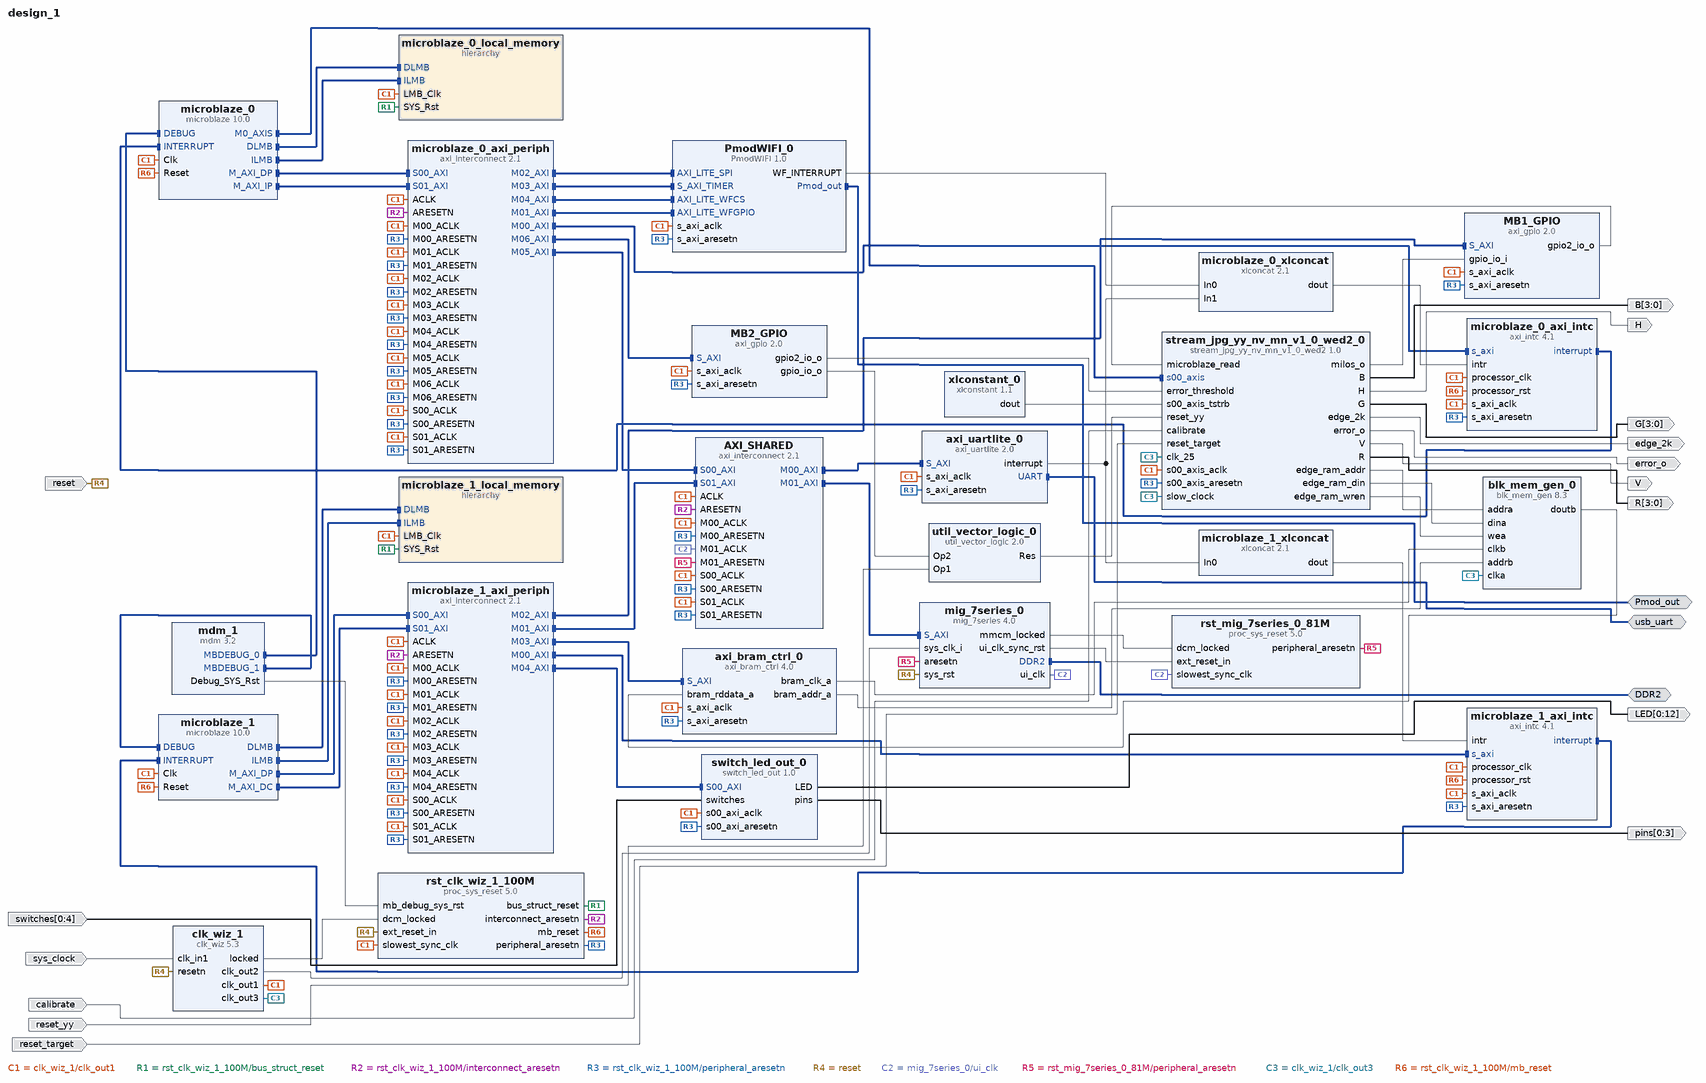
[diagram p0: block diagram of the top level]
# Vivado block design design_1, xc7a100tcsg324-1, Vivado 2016.4
create_bd_design design_1

create_bd_intf_port -mode Master -vlnv xilinx.com:interface:ddrx_rtl:1.0 DDR2
create_bd_intf_port -mode Master -vlnv digilentinc.com:interface:pmod_rtl:1.0 Pmod_out
create_bd_intf_port -mode Master -vlnv xilinx.com:interface:uart_rtl:1.0 usb_uart
create_bd_port -dir I -type rst reset
set_property -dict {CONFIG.POLARITY ACTIVE_LOW} [get_bd_ports reset]
create_bd_port -dir I -type clk sys_clock
set_property -dict {CONFIG.FREQ_HZ 100000000 CONFIG.PHASE 0.000} [get_bd_ports sys_clock]
create_bd_port -dir O H
create_bd_port -dir O V
create_bd_port -dir O -from 3 -to 0 G
create_bd_port -dir O -from 3 -to 0 B
create_bd_port -dir O -from 3 -to 0 R
create_bd_port -dir I calibrate
create_bd_port -dir O error_o
create_bd_port -dir O -from 0 -to 12 LED
create_bd_port -dir O -from 0 -to 3 pins
create_bd_port -dir I reset_yy
create_bd_port -dir O edge_2k
create_bd_port -dir I reset_target
create_bd_port -dir I -from 0 -to 4 switches

create_bd_cell -type hier microblaze_0_local_memory
create_bd_cell -type ip -vlnv xilinx.com:ip:xlconcat:2.1 microblaze_0_xlconcat
set_property -dict {CONFIG.NUM_PORTS 2} [get_bd_cells microblaze_0_xlconcat]
create_bd_cell -type hier microblaze_1_local_memory
create_bd_cell -type ip -vlnv xilinx.com:ip:xlconcat:2.1 microblaze_1_xlconcat
set_property -dict {CONFIG.NUM_PORTS 1} [get_bd_cells microblaze_1_xlconcat]
create_bd_cell -type ip -vlnv user:user:switch_led_out:1.0 switch_led_out_0
create_bd_cell -type ip -vlnv xilinx.com:ip:util_vector_logic:2.0 util_vector_logic_0
set_property -dict {CONFIG.C_SIZE 1 CONFIG.C_OPERATION or} [get_bd_cells util_vector_logic_0]
create_bd_cell -type ip -vlnv xilinx.com:ip:xlconstant:1.1 xlconstant_0
set_property -dict {CONFIG.CONST_WIDTH 4 CONFIG.CONST_VAL 0} [get_bd_cells xlconstant_0]
create_bd_cell -type ip -vlnv user:user:stream_jpg_yy_nv_mn_v1_0_wed2:1.0 stream_jpg_yy_nv_mn_v1_0_wed2_0
create_bd_cell -type ip -vlnv xilinx.com:ip:axi_gpio:2.0 MB2_GPIO
set_property -dict [list \
  CONFIG.C_GPIO_WIDTH 1 \
  CONFIG.C_GPIO2_WIDTH 16 \
  CONFIG.C_IS_DUAL 1 \
  CONFIG.C_ALL_INPUTS 0 \
  CONFIG.C_ALL_INPUTS_2 0 \
  CONFIG.C_ALL_OUTPUTS 1 \
  CONFIG.C_ALL_OUTPUTS_2 1 \
] [get_bd_cells MB2_GPIO]
create_bd_cell -type ip -vlnv digilentinc.com:IP:PmodWIFI:1.0 PmodWIFI_0
create_bd_cell -type ip -vlnv xilinx.com:ip:axi_bram_ctrl:4.0 axi_bram_ctrl_0
set_property -dict {CONFIG.PROTOCOL AXI4LITE CONFIG.SINGLE_PORT_BRAM 1} [get_bd_cells axi_bram_ctrl_0]
create_bd_cell -type ip -vlnv xilinx.com:ip:axi_gpio:2.0 MB1_GPIO
set_property -dict [list \
  CONFIG.C_IS_DUAL 1 \
  CONFIG.C_ALL_INPUTS 1 \
  CONFIG.C_ALL_INPUTS_2 0 \
  CONFIG.C_ALL_OUTPUTS_2 1 \
] [get_bd_cells MB1_GPIO]
create_bd_cell -type ip -vlnv xilinx.com:ip:axi_uartlite:2.0 axi_uartlite_0
set_property -dict {CONFIG.USE_BOARD_FLOW true CONFIG.UARTLITE_BOARD_INTERFACE USB_Uart} [get_bd_cells axi_uartlite_0]
create_bd_cell -type ip -vlnv xilinx.com:ip:blk_mem_gen:8.3 blk_mem_gen_0
set_property -dict [list \
  CONFIG.Memory_Type Simple_Dual_Port_RAM \
  CONFIG.Enable_32bit_Address false \
  CONFIG.Use_Byte_Write_Enable false \
  CONFIG.Write_Width_A 20 \
  CONFIG.Operating_Mode_A NO_CHANGE \
  CONFIG.Enable_A Always_Enabled \
  CONFIG.Write_Width_B 20 \
  CONFIG.Read_Width_B 20 \
  CONFIG.Enable_B Always_Enabled \
  CONFIG.Register_PortB_Output_of_Memory_Primitives true \
  CONFIG.Load_Init_File true \
  CONFIG.Coe_File ../../../../edge_ram_init.coe \
  CONFIG.Port_B_Clock 100 \
  CONFIG.Port_B_Enable_Rate 100 \
  CONFIG.use_bram_block Stand_Alone \
] [get_bd_cells blk_mem_gen_0]
create_bd_cell -type ip -vlnv xilinx.com:ip:clk_wiz:5.3 clk_wiz_1
set_property -dict [list \
  CONFIG.CLKOUT2_USED true \
  CONFIG.CLKOUT3_USED true \
  CONFIG.CLKOUT4_USED false \
  CONFIG.NUM_OUT_CLKS 3 \
  CONFIG.CLKOUT1_REQUESTED_OUT_FREQ 100.000 \
  CONFIG.CLKOUT2_REQUESTED_OUT_FREQ 200.000 \
  CONFIG.CLKOUT3_REQUESTED_OUT_FREQ 25 \
  CONFIG.CLKOUT4_REQUESTED_OUT_FREQ 100.000 \
  CONFIG.PRIM_SOURCE Single_ended_clock_capable_pin \
  CONFIG.RESET_PORT resetn \
  CONFIG.MMCM_DIVCLK_DIVIDE 1 \
  CONFIG.MMCM_CLKOUT0_DIVIDE_F 10.000 \
  CONFIG.MMCM_CLKOUT1_DIVIDE 5 \
  CONFIG.MMCM_CLKOUT2_DIVIDE 40 \
  CONFIG.MMCM_CLKOUT3_DIVIDE 1 \
  CONFIG.RESET_TYPE ACTIVE_LOW \
  CONFIG.USE_BOARD_FLOW true \
  CONFIG.CLK_IN1_BOARD_INTERFACE Custom \
  CONFIG.RESET_BOARD_INTERFACE reset \
  CONFIG.CLKOUT1_JITTER 130.958 \
  CONFIG.CLKOUT2_JITTER 114.829 \
  CONFIG.CLKOUT2_PHASE_ERROR 98.575 \
  CONFIG.CLKOUT3_JITTER 175.402 \
  CONFIG.CLKOUT3_PHASE_ERROR 98.575 \
  CONFIG.CLKOUT4_JITTER 151.636 \
  CONFIG.CLKOUT4_PHASE_ERROR 98.575 \
] [get_bd_cells clk_wiz_1]
create_bd_cell -type ip -vlnv xilinx.com:ip:mdm:3.2 mdm_1
set_property -dict {CONFIG.C_MB_DBG_PORTS 2} [get_bd_cells mdm_1]
create_bd_cell -type ip -vlnv xilinx.com:ip:microblaze:10.0 microblaze_0
set_property -dict [list \
  CONFIG.C_AREA_OPTIMIZED 1 \
  CONFIG.C_D_AXI 1 \
  CONFIG.C_D_LMB 1 \
  CONFIG.C_I_AXI 1 \
  CONFIG.C_I_LMB 1 \
  CONFIG.C_USE_REORDER_INSTR 0 \
  CONFIG.C_USE_BARREL 1 \
  CONFIG.C_USE_DIV 1 \
  CONFIG.C_USE_HW_MUL 1 \
  CONFIG.C_USE_FPU 1 \
  CONFIG.C_DEBUG_ENABLED 1 \
  CONFIG.C_FSL_LINKS 1 \
  CONFIG.C_USE_EXTENDED_FSL_INSTR 1 \
] [get_bd_cells microblaze_0]
create_bd_cell -type ip -vlnv xilinx.com:ip:axi_intc:4.1 microblaze_0_axi_intc
set_property -dict {CONFIG.C_HAS_FAST 1} [get_bd_cells microblaze_0_axi_intc]
create_bd_cell -type ip -vlnv xilinx.com:ip:axi_interconnect:2.1 microblaze_0_axi_periph
set_property -dict [list \
  CONFIG.NUM_SI 2 \
  CONFIG.NUM_MI 7 \
  CONFIG.ENABLE_ADVANCED_OPTIONS 1 \
  CONFIG.M00_HAS_REGSLICE 3 \
  CONFIG.M01_HAS_REGSLICE 3 \
  CONFIG.M02_HAS_REGSLICE 3 \
  CONFIG.M03_HAS_REGSLICE 3 \
  CONFIG.M04_HAS_REGSLICE 3 \
  CONFIG.M05_HAS_REGSLICE 3 \
  CONFIG.M06_HAS_REGSLICE 3 \
  CONFIG.S00_HAS_REGSLICE 3 \
  CONFIG.S01_HAS_REGSLICE 3 \
  CONFIG.S02_HAS_REGSLICE 3 \
] [get_bd_cells microblaze_0_axi_periph]
create_bd_cell -type ip -vlnv xilinx.com:ip:axi_interconnect:2.1 AXI_SHARED
set_property -dict [list \
  CONFIG.NUM_SI 2 \
  CONFIG.NUM_MI 2 \
  CONFIG.ENABLE_ADVANCED_OPTIONS 1 \
  CONFIG.M00_HAS_REGSLICE 3 \
  CONFIG.M01_HAS_REGSLICE 3 \
  CONFIG.M02_HAS_REGSLICE 3 \
  CONFIG.M03_HAS_REGSLICE 3 \
  CONFIG.M04_HAS_REGSLICE 3 \
  CONFIG.M05_HAS_REGSLICE 3 \
  CONFIG.M06_HAS_REGSLICE 3 \
  CONFIG.S00_HAS_REGSLICE 3 \
  CONFIG.S01_HAS_REGSLICE 3 \
  CONFIG.S02_HAS_REGSLICE 3 \
] [get_bd_cells AXI_SHARED]
create_bd_cell -type ip -vlnv xilinx.com:ip:microblaze:10.0 microblaze_1
set_property -dict [list \
  CONFIG.C_D_AXI 1 \
  CONFIG.C_D_LMB 1 \
  CONFIG.C_I_LMB 1 \
  CONFIG.C_USE_MSR_INSTR 1 \
  CONFIG.C_USE_PCMP_INSTR 1 \
  CONFIG.C_USE_BARREL 1 \
  CONFIG.C_USE_DIV 1 \
  CONFIG.C_USE_HW_MUL 1 \
  CONFIG.C_USE_FPU 1 \
  CONFIG.C_DEBUG_ENABLED 1 \
  CONFIG.C_USE_ICACHE 0 \
  CONFIG.C_USE_DCACHE 1 \
  CONFIG.C_DCACHE_BYTE_SIZE 65536 \
  CONFIG.C_DCACHE_USE_WRITEBACK 1 \
  CONFIG.C_DCACHE_VICTIMS 0 \
  CONFIG.C_DCACHE_DATA_WIDTH 2 \
  CONFIG.C_USE_BRANCH_TARGET_CACHE 1 \
  CONFIG.C_BRANCH_TARGET_CACHE_SIZE 7 \
] [get_bd_cells microblaze_1]
create_bd_cell -type ip -vlnv xilinx.com:ip:axi_intc:4.1 microblaze_1_axi_intc
set_property -dict {CONFIG.C_HAS_FAST 1} [get_bd_cells microblaze_1_axi_intc]
create_bd_cell -type ip -vlnv xilinx.com:ip:axi_interconnect:2.1 microblaze_1_axi_periph
set_property -dict [list \
  CONFIG.NUM_SI 2 \
  CONFIG.NUM_MI 5 \
  CONFIG.ENABLE_ADVANCED_OPTIONS 1 \
  CONFIG.M00_HAS_REGSLICE 3 \
  CONFIG.S00_HAS_REGSLICE 3 \
  CONFIG.S01_HAS_REGSLICE 3 \
] [get_bd_cells microblaze_1_axi_periph]
create_bd_cell -type ip -vlnv xilinx.com:ip:mig_7series:4.0 mig_7series_0
create_bd_cell -type ip -vlnv xilinx.com:ip:proc_sys_reset:5.0 rst_clk_wiz_1_100M
set_property -dict {CONFIG.USE_BOARD_FLOW false CONFIG.RESET_BOARD_INTERFACE Custom} [get_bd_cells rst_clk_wiz_1_100M]
create_bd_cell -type ip -vlnv xilinx.com:ip:proc_sys_reset:5.0 rst_mig_7series_0_81M

# ---- hierarchy /microblaze_0_local_memory ----
current_bd_instance /microblaze_0_local_memory
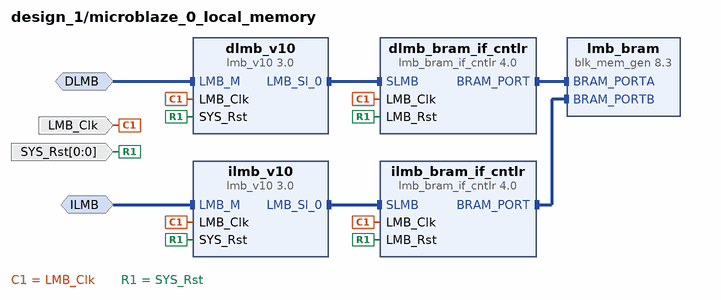
[diagram p1: block diagram inside /microblaze_0_local_memory]
create_bd_intf_pin -mode MirroredMaster -vlnv xilinx.com:interface:lmb_rtl:1.0 DLMB
create_bd_intf_pin -mode MirroredMaster -vlnv xilinx.com:interface:lmb_rtl:1.0 ILMB
create_bd_pin -dir I -type clk LMB_Clk
create_bd_pin -dir I -from 0 -to 0 -type rst SYS_Rst

create_bd_cell -type ip -vlnv xilinx.com:ip:lmb_bram_if_cntlr:4.0 dlmb_bram_if_cntlr
set_property -dict {CONFIG.C_ECC 0} [get_bd_cells dlmb_bram_if_cntlr]
create_bd_cell -type ip -vlnv xilinx.com:ip:lmb_v10:3.0 dlmb_v10
create_bd_cell -type ip -vlnv xilinx.com:ip:lmb_bram_if_cntlr:4.0 ilmb_bram_if_cntlr
set_property -dict {CONFIG.C_ECC 0} [get_bd_cells ilmb_bram_if_cntlr]
create_bd_cell -type ip -vlnv xilinx.com:ip:lmb_v10:3.0 ilmb_v10
create_bd_cell -type ip -vlnv xilinx.com:ip:blk_mem_gen:8.3 lmb_bram
set_property -dict {CONFIG.Memory_Type True_Dual_Port_RAM CONFIG.use_bram_block BRAM_Controller} [get_bd_cells lmb_bram]

# ---- hierarchy /microblaze_1_local_memory ----
current_bd_instance /microblaze_1_local_memory
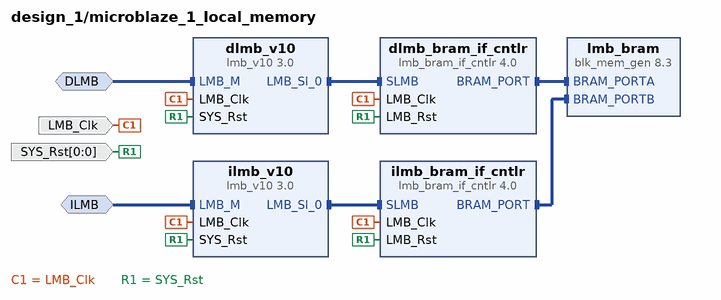
[diagram p2: block diagram inside /microblaze_1_local_memory]
create_bd_intf_pin -mode MirroredMaster -vlnv xilinx.com:interface:lmb_rtl:1.0 DLMB
create_bd_intf_pin -mode MirroredMaster -vlnv xilinx.com:interface:lmb_rtl:1.0 ILMB
create_bd_pin -dir I -type clk LMB_Clk
create_bd_pin -dir I -from 0 -to 0 -type rst SYS_Rst

create_bd_cell -type ip -vlnv xilinx.com:ip:lmb_bram_if_cntlr:4.0 dlmb_bram_if_cntlr
set_property -dict {CONFIG.C_ECC 0} [get_bd_cells dlmb_bram_if_cntlr]
create_bd_cell -type ip -vlnv xilinx.com:ip:lmb_v10:3.0 dlmb_v10
create_bd_cell -type ip -vlnv xilinx.com:ip:lmb_bram_if_cntlr:4.0 ilmb_bram_if_cntlr
set_property -dict {CONFIG.C_ECC 0} [get_bd_cells ilmb_bram_if_cntlr]
create_bd_cell -type ip -vlnv xilinx.com:ip:lmb_v10:3.0 ilmb_v10
create_bd_cell -type ip -vlnv xilinx.com:ip:blk_mem_gen:8.3 lmb_bram
set_property -dict {CONFIG.Memory_Type True_Dual_Port_RAM CONFIG.use_bram_block BRAM_Controller} [get_bd_cells lmb_bram]

# ---- connections ----

current_bd_instance /microblaze_0_local_memory
connect_bd_intf_net [get_bd_intf_pins dlmb_v10/LMB_Sl_0] [get_bd_intf_pins dlmb_bram_if_cntlr/SLMB]
connect_bd_intf_net [get_bd_intf_pins ilmb_v10/LMB_Sl_0] [get_bd_intf_pins ilmb_bram_if_cntlr/SLMB]
connect_bd_intf_net [get_bd_intf_pins dlmb_bram_if_cntlr/BRAM_PORT] [get_bd_intf_pins lmb_bram/BRAM_PORTA]
connect_bd_intf_net [get_bd_intf_pins ilmb_bram_if_cntlr/BRAM_PORT] [get_bd_intf_pins lmb_bram/BRAM_PORTB]
connect_bd_intf_net [get_bd_intf_pins DLMB] [get_bd_intf_pins dlmb_v10/LMB_M]
connect_bd_intf_net [get_bd_intf_pins ILMB] [get_bd_intf_pins ilmb_v10/LMB_M]
connect_bd_net -net microblaze_0_Clk [get_bd_pins LMB_Clk] \
  [get_bd_pins dlmb_bram_if_cntlr/LMB_Clk] [get_bd_pins dlmb_v10/LMB_Clk] [get_bd_pins ilmb_bram_if_cntlr/LMB_Clk] \
  [get_bd_pins ilmb_v10/LMB_Clk]
connect_bd_net [get_bd_pins SYS_Rst] \
  [get_bd_pins dlmb_bram_if_cntlr/LMB_Rst] [get_bd_pins dlmb_v10/SYS_Rst] [get_bd_pins ilmb_bram_if_cntlr/LMB_Rst] \
  [get_bd_pins ilmb_v10/SYS_Rst]

current_bd_instance /microblaze_1_local_memory
connect_bd_intf_net [get_bd_intf_pins dlmb_v10/LMB_Sl_0] [get_bd_intf_pins dlmb_bram_if_cntlr/SLMB]
connect_bd_intf_net [get_bd_intf_pins ilmb_v10/LMB_Sl_0] [get_bd_intf_pins ilmb_bram_if_cntlr/SLMB]
connect_bd_intf_net [get_bd_intf_pins dlmb_bram_if_cntlr/BRAM_PORT] [get_bd_intf_pins lmb_bram/BRAM_PORTA]
connect_bd_intf_net [get_bd_intf_pins ilmb_bram_if_cntlr/BRAM_PORT] [get_bd_intf_pins lmb_bram/BRAM_PORTB]
connect_bd_intf_net [get_bd_intf_pins DLMB] [get_bd_intf_pins dlmb_v10/LMB_M]
connect_bd_intf_net [get_bd_intf_pins ILMB] [get_bd_intf_pins ilmb_v10/LMB_M]
connect_bd_net -net microblaze_1_Clk [get_bd_pins LMB_Clk] \
  [get_bd_pins dlmb_bram_if_cntlr/LMB_Clk] [get_bd_pins dlmb_v10/LMB_Clk] [get_bd_pins ilmb_bram_if_cntlr/LMB_Clk] \
  [get_bd_pins ilmb_v10/LMB_Clk]
connect_bd_net [get_bd_pins SYS_Rst] \
  [get_bd_pins dlmb_bram_if_cntlr/LMB_Rst] [get_bd_pins dlmb_v10/SYS_Rst] [get_bd_pins ilmb_bram_if_cntlr/LMB_Rst] \
  [get_bd_pins ilmb_v10/SYS_Rst]

current_bd_instance /
connect_bd_intf_net [get_bd_intf_pins microblaze_0/DLMB] [get_bd_intf_pins microblaze_0_local_memory/DLMB]
connect_bd_intf_net [get_bd_intf_pins microblaze_0/ILMB] [get_bd_intf_pins microblaze_0_local_memory/ILMB]
connect_bd_intf_net [get_bd_intf_pins microblaze_0_axi_periph/S00_AXI] [get_bd_intf_pins microblaze_0/M_AXI_DP]
connect_bd_intf_net [get_bd_intf_pins microblaze_0_axi_intc/interrupt] [get_bd_intf_pins microblaze_0/INTERRUPT]
connect_bd_intf_net [get_bd_intf_pins microblaze_0_axi_periph/M00_AXI] [get_bd_intf_pins microblaze_0_axi_intc/s_axi]
connect_bd_intf_net [get_bd_intf_pins mdm_1/MBDEBUG_0] [get_bd_intf_pins microblaze_0/DEBUG]
connect_bd_intf_net [get_bd_intf_pins microblaze_0/M_AXI_IP] [get_bd_intf_pins microblaze_0_axi_periph/S01_AXI]
connect_bd_intf_net [get_bd_intf_pins stream_jpg_yy_nv_mn_v1_0_wed2_0/s00_axis] [get_bd_intf_pins microblaze_0/M0_AXIS]
connect_bd_intf_net [get_bd_intf_pins microblaze_0_axi_periph/M02_AXI] [get_bd_intf_pins PmodWIFI_0/AXI_LITE_SPI]
connect_bd_intf_net [get_bd_intf_pins microblaze_0_axi_periph/M03_AXI] [get_bd_intf_pins PmodWIFI_0/S_AXI_TIMER]
connect_bd_intf_net [get_bd_intf_pins microblaze_0_axi_periph/M04_AXI] [get_bd_intf_pins PmodWIFI_0/AXI_LITE_WFCS]
connect_bd_intf_net [get_bd_intf_pins microblaze_1/DLMB] [get_bd_intf_pins microblaze_1_local_memory/DLMB]
connect_bd_intf_net [get_bd_intf_pins microblaze_1/ILMB] [get_bd_intf_pins microblaze_1_local_memory/ILMB]
connect_bd_intf_net [get_bd_intf_pins microblaze_1_axi_periph/S00_AXI] [get_bd_intf_pins microblaze_1/M_AXI_DP]
connect_bd_intf_net [get_bd_intf_pins microblaze_1_axi_intc/interrupt] [get_bd_intf_pins microblaze_1/INTERRUPT]
connect_bd_intf_net [get_bd_intf_pins microblaze_1_axi_periph/M00_AXI] [get_bd_intf_pins microblaze_1_axi_intc/s_axi]
connect_bd_intf_net [get_bd_intf_pins mdm_1/MBDEBUG_1] [get_bd_intf_pins microblaze_1/DEBUG]
connect_bd_intf_net [get_bd_intf_pins microblaze_1/M_AXI_DC] [get_bd_intf_pins microblaze_1_axi_periph/S01_AXI]
connect_bd_intf_net [get_bd_intf_pins axi_uartlite_0/S_AXI] [get_bd_intf_pins AXI_SHARED/M00_AXI]
connect_bd_intf_net [get_bd_intf_pins mig_7series_0/S_AXI] [get_bd_intf_pins AXI_SHARED/M01_AXI]
connect_bd_intf_net [get_bd_intf_pins PmodWIFI_0/AXI_LITE_WFGPIO] [get_bd_intf_pins microblaze_0_axi_periph/M01_AXI]
connect_bd_intf_net [get_bd_intf_pins microblaze_0_axi_periph/M05_AXI] [get_bd_intf_pins AXI_SHARED/S00_AXI]
connect_bd_intf_net [get_bd_intf_pins microblaze_1_axi_periph/M01_AXI] [get_bd_intf_pins AXI_SHARED/S01_AXI]
connect_bd_intf_net [get_bd_intf_pins MB1_GPIO/S_AXI] [get_bd_intf_pins microblaze_1_axi_periph/M02_AXI]
connect_bd_intf_net [get_bd_intf_pins axi_bram_ctrl_0/S_AXI] [get_bd_intf_pins microblaze_1_axi_periph/M03_AXI]
connect_bd_intf_net [get_bd_intf_pins microblaze_0_axi_periph/M06_AXI] [get_bd_intf_pins MB2_GPIO/S_AXI]
connect_bd_intf_net [get_bd_intf_pins switch_led_out_0/S00_AXI] [get_bd_intf_pins microblaze_1_axi_periph/M04_AXI]
connect_bd_intf_net [get_bd_intf_ports DDR2] [get_bd_intf_pins mig_7series_0/DDR2]
connect_bd_intf_net [get_bd_intf_ports Pmod_out] [get_bd_intf_pins PmodWIFI_0/Pmod_out]
connect_bd_intf_net [get_bd_intf_ports usb_uart] [get_bd_intf_pins axi_uartlite_0/UART]
connect_bd_net -net microblaze_0_intr [get_bd_pins microblaze_0_xlconcat/dout] [get_bd_pins microblaze_0_axi_intc/intr]
connect_bd_net -net microblaze_1_Clk [get_bd_pins clk_wiz_1/clk_out1] \
  [get_bd_pins switch_led_out_0/s00_axi_aclk] [get_bd_pins stream_jpg_yy_nv_mn_v1_0_wed2_0/s00_axis_aclk] \
  [get_bd_pins MB2_GPIO/s_axi_aclk] [get_bd_pins PmodWIFI_0/s_axi_aclk] [get_bd_pins axi_bram_ctrl_0/s_axi_aclk] \
  [get_bd_pins MB1_GPIO/s_axi_aclk] [get_bd_pins axi_uartlite_0/s_axi_aclk] [get_bd_pins microblaze_0/Clk] \
  [get_bd_pins microblaze_0_axi_intc/s_axi_aclk] [get_bd_pins microblaze_0_axi_intc/processor_clk] \
  [get_bd_pins microblaze_1/Clk] [get_bd_pins microblaze_1_axi_intc/s_axi_aclk] \
  [get_bd_pins microblaze_1_axi_intc/processor_clk] [get_bd_pins rst_clk_wiz_1_100M/slowest_sync_clk] \
  [get_bd_pins microblaze_0_local_memory/LMB_Clk] [get_bd_pins microblaze_1_local_memory/LMB_Clk] \
  [get_bd_pins microblaze_0_axi_periph/ACLK] [get_bd_pins microblaze_0_axi_periph/S00_ACLK] \
  [get_bd_pins microblaze_0_axi_periph/M00_ACLK] [get_bd_pins microblaze_0_axi_periph/M01_ACLK] \
  [get_bd_pins microblaze_0_axi_periph/M02_ACLK] [get_bd_pins microblaze_0_axi_periph/M03_ACLK] \
  [get_bd_pins microblaze_0_axi_periph/M04_ACLK] [get_bd_pins microblaze_0_axi_periph/M05_ACLK] \
  [get_bd_pins microblaze_0_axi_periph/S01_ACLK] [get_bd_pins microblaze_0_axi_periph/M06_ACLK] [get_bd_pins AXI_SHARED/ACLK] \
  [get_bd_pins AXI_SHARED/S00_ACLK] [get_bd_pins AXI_SHARED/M00_ACLK] [get_bd_pins AXI_SHARED/S01_ACLK] \
  [get_bd_pins microblaze_1_axi_periph/ACLK] [get_bd_pins microblaze_1_axi_periph/S00_ACLK] \
  [get_bd_pins microblaze_1_axi_periph/M00_ACLK] [get_bd_pins microblaze_1_axi_periph/M01_ACLK] \
  [get_bd_pins microblaze_1_axi_periph/S01_ACLK] [get_bd_pins microblaze_1_axi_periph/M02_ACLK] \
  [get_bd_pins microblaze_1_axi_periph/M03_ACLK] [get_bd_pins microblaze_1_axi_periph/M04_ACLK]
connect_bd_net [get_bd_pins clk_wiz_1/locked] [get_bd_pins rst_clk_wiz_1_100M/dcm_locked]
connect_bd_net [get_bd_pins rst_clk_wiz_1_100M/bus_struct_reset] \
  [get_bd_pins microblaze_0_local_memory/SYS_Rst] [get_bd_pins microblaze_1_local_memory/SYS_Rst]
connect_bd_net [get_bd_pins rst_clk_wiz_1_100M/interconnect_aresetn] \
  [get_bd_pins microblaze_0_axi_periph/ARESETN] [get_bd_pins AXI_SHARED/ARESETN] \
  [get_bd_pins microblaze_1_axi_periph/ARESETN]
connect_bd_net [get_bd_pins rst_clk_wiz_1_100M/peripheral_aresetn] \
  [get_bd_pins switch_led_out_0/s00_axi_aresetn] [get_bd_pins stream_jpg_yy_nv_mn_v1_0_wed2_0/s00_axis_aresetn] \
  [get_bd_pins MB2_GPIO/s_axi_aresetn] [get_bd_pins PmodWIFI_0/s_axi_aresetn] [get_bd_pins axi_bram_ctrl_0/s_axi_aresetn] \
  [get_bd_pins MB1_GPIO/s_axi_aresetn] [get_bd_pins axi_uartlite_0/s_axi_aresetn] \
  [get_bd_pins microblaze_0_axi_intc/s_axi_aresetn] [get_bd_pins microblaze_1_axi_intc/s_axi_aresetn] \
  [get_bd_pins microblaze_0_axi_periph/S00_ARESETN] [get_bd_pins microblaze_0_axi_periph/M00_ARESETN] \
  [get_bd_pins microblaze_0_axi_periph/M01_ARESETN] [get_bd_pins microblaze_0_axi_periph/M02_ARESETN] \
  [get_bd_pins microblaze_0_axi_periph/M03_ARESETN] [get_bd_pins microblaze_0_axi_periph/M04_ARESETN] \
  [get_bd_pins microblaze_0_axi_periph/M05_ARESETN] [get_bd_pins microblaze_0_axi_periph/S01_ARESETN] \
  [get_bd_pins microblaze_0_axi_periph/M06_ARESETN] [get_bd_pins AXI_SHARED/S00_ARESETN] [get_bd_pins AXI_SHARED/M00_ARESETN] \
  [get_bd_pins AXI_SHARED/S01_ARESETN] [get_bd_pins microblaze_1_axi_periph/S00_ARESETN] \
  [get_bd_pins microblaze_1_axi_periph/M00_ARESETN] [get_bd_pins microblaze_1_axi_periph/M01_ARESETN] \
  [get_bd_pins microblaze_1_axi_periph/S01_ARESETN] [get_bd_pins microblaze_1_axi_periph/M02_ARESETN] \
  [get_bd_pins microblaze_1_axi_periph/M03_ARESETN] [get_bd_pins microblaze_1_axi_periph/M04_ARESETN]
connect_bd_net [get_bd_pins mdm_1/Debug_SYS_Rst] [get_bd_pins rst_clk_wiz_1_100M/mb_debug_sys_rst]
connect_bd_net [get_bd_ports reset] [get_bd_pins clk_wiz_1/resetn] [get_bd_pins mig_7series_0/sys_rst] [get_bd_pins rst_clk_wiz_1_100M/ext_reset_in]
connect_bd_net [get_bd_ports sys_clock] [get_bd_pins clk_wiz_1/clk_in1]
connect_bd_net [get_bd_pins mig_7series_0/ui_clk] [get_bd_pins rst_mig_7series_0_81M/slowest_sync_clk] [get_bd_pins AXI_SHARED/M01_ACLK]
connect_bd_net [get_bd_pins mig_7series_0/mmcm_locked] [get_bd_pins rst_mig_7series_0_81M/dcm_locked]
connect_bd_net [get_bd_pins mig_7series_0/ui_clk_sync_rst] [get_bd_pins rst_mig_7series_0_81M/ext_reset_in]
connect_bd_net [get_bd_pins stream_jpg_yy_nv_mn_v1_0_wed2_0/H] [get_bd_ports H]
connect_bd_net [get_bd_pins stream_jpg_yy_nv_mn_v1_0_wed2_0/V] [get_bd_ports V]
connect_bd_net [get_bd_pins stream_jpg_yy_nv_mn_v1_0_wed2_0/G] [get_bd_ports G]
connect_bd_net [get_bd_pins stream_jpg_yy_nv_mn_v1_0_wed2_0/B] [get_bd_ports B]
connect_bd_net [get_bd_pins stream_jpg_yy_nv_mn_v1_0_wed2_0/R] [get_bd_ports R]
connect_bd_net [get_bd_pins rst_mig_7series_0_81M/peripheral_aresetn] [get_bd_pins mig_7series_0/aresetn] [get_bd_pins AXI_SHARED/M01_ARESETN]
connect_bd_net [get_bd_pins clk_wiz_1/clk_out2] [get_bd_pins mig_7series_0/sys_clk_i]
connect_bd_net [get_bd_pins clk_wiz_1/clk_out3] \
  [get_bd_pins stream_jpg_yy_nv_mn_v1_0_wed2_0/slow_clock] [get_bd_pins stream_jpg_yy_nv_mn_v1_0_wed2_0/clk_25] \
  [get_bd_pins blk_mem_gen_0/clka]
connect_bd_net [get_bd_pins rst_clk_wiz_1_100M/mb_reset] \
  [get_bd_pins microblaze_0/Reset] [get_bd_pins microblaze_0_axi_intc/processor_rst] [get_bd_pins microblaze_1/Reset] \
  [get_bd_pins microblaze_1_axi_intc/processor_rst]
connect_bd_net [get_bd_ports calibrate] [get_bd_pins stream_jpg_yy_nv_mn_v1_0_wed2_0/calibrate]
connect_bd_net [get_bd_pins stream_jpg_yy_nv_mn_v1_0_wed2_0/error_o] [get_bd_ports error_o]
connect_bd_net [get_bd_pins PmodWIFI_0/WF_INTERRUPT] [get_bd_pins microblaze_0_xlconcat/In0]
connect_bd_net [get_bd_pins axi_uartlite_0/interrupt] [get_bd_pins microblaze_0_xlconcat/In1] [get_bd_pins microblaze_1_xlconcat/In0]
connect_bd_net -net microblaze_1_intr [get_bd_pins microblaze_1_xlconcat/dout] [get_bd_pins microblaze_1_axi_intc/intr]
connect_bd_net [get_bd_pins switch_led_out_0/LED] [get_bd_ports LED]
connect_bd_net [get_bd_pins switch_led_out_0/pins] [get_bd_ports pins]
connect_bd_net [get_bd_pins MB1_GPIO/gpio2_io_o] [get_bd_pins stream_jpg_yy_nv_mn_v1_0_wed2_0/microblaze_read]
connect_bd_net -net stream_jpg_yy_nv_mn_v1_0_wed2_0_img_proc_write [get_bd_pins stream_jpg_yy_nv_mn_v1_0_wed2_0/milos_o] \
  [get_bd_pins MB1_GPIO/gpio_io_i]
connect_bd_net [get_bd_pins blk_mem_gen_0/doutb] [get_bd_pins axi_bram_ctrl_0/bram_rddata_a]
connect_bd_net [get_bd_pins axi_bram_ctrl_0/bram_clk_a] [get_bd_pins blk_mem_gen_0/clkb]
connect_bd_net [get_bd_pins axi_bram_ctrl_0/bram_addr_a] [get_bd_pins blk_mem_gen_0/addrb]
connect_bd_net [get_bd_pins stream_jpg_yy_nv_mn_v1_0_wed2_0/edge_ram_addr] [get_bd_pins blk_mem_gen_0/addra]
connect_bd_net [get_bd_pins stream_jpg_yy_nv_mn_v1_0_wed2_0/edge_ram_din] [get_bd_pins blk_mem_gen_0/dina]
connect_bd_net [get_bd_pins stream_jpg_yy_nv_mn_v1_0_wed2_0/edge_ram_wren] [get_bd_pins blk_mem_gen_0/wea]
connect_bd_net [get_bd_ports reset_yy] [get_bd_pins util_vector_logic_0/Op1]
connect_bd_net [get_bd_pins util_vector_logic_0/Res] [get_bd_pins stream_jpg_yy_nv_mn_v1_0_wed2_0/reset_yy]
connect_bd_net [get_bd_pins MB2_GPIO/gpio_io_o] [get_bd_pins util_vector_logic_0/Op2]
connect_bd_net [get_bd_pins MB2_GPIO/gpio2_io_o] [get_bd_pins stream_jpg_yy_nv_mn_v1_0_wed2_0/error_threshold]
connect_bd_net [get_bd_pins stream_jpg_yy_nv_mn_v1_0_wed2_0/edge_2k] [get_bd_ports edge_2k]
connect_bd_net [get_bd_pins xlconstant_0/dout] [get_bd_pins stream_jpg_yy_nv_mn_v1_0_wed2_0/s00_axis_tstrb]
connect_bd_net [get_bd_ports reset_target] [get_bd_pins stream_jpg_yy_nv_mn_v1_0_wed2_0/reset_target]
connect_bd_net [get_bd_ports switches] [get_bd_pins switch_led_out_0/switches]

# ---- address map ----
assign_bd_address -offset 0x00000000 -range 64K -target_address_space [get_bd_addr_spaces microblaze_0/Data] [get_bd_addr_segs microblaze_0_local_memory/dlmb_bram_if_cntlr/SLMB/Mem]
assign_bd_address -offset 0x40010000 -range 64K -target_address_space [get_bd_addr_spaces microblaze_0/Data] [get_bd_addr_segs MB2_GPIO/S_AXI/Reg]
assign_bd_address -offset 0x40600000 -range 64K -target_address_space [get_bd_addr_spaces microblaze_0/Data] [get_bd_addr_segs axi_uartlite_0/S_AXI/Reg]
assign_bd_address -offset 0x41200000 -range 64K -target_address_space [get_bd_addr_spaces microblaze_0/Data] [get_bd_addr_segs microblaze_0_axi_intc/S_AXI/Reg]
assign_bd_address -offset 0x44A00000 -range 64K -target_address_space [get_bd_addr_spaces microblaze_0/Data] [get_bd_addr_segs PmodWIFI_0/AXI_LITE_SPI/Reg0]
assign_bd_address -offset 0x44A10000 -range 64K -target_address_space [get_bd_addr_spaces microblaze_0/Data] [get_bd_addr_segs PmodWIFI_0/S_AXI_TIMER/Reg0]
assign_bd_address -offset 0x44A20000 -range 64K -target_address_space [get_bd_addr_spaces microblaze_0/Data] [get_bd_addr_segs PmodWIFI_0/AXI_LITE_GPIO_WFCS/Reg0]
assign_bd_address -offset 0x44A30000 -range 64K -target_address_space [get_bd_addr_spaces microblaze_0/Data] [get_bd_addr_segs PmodWIFI_0/AXI_LITE_WFGPIO/Reg0]
assign_bd_address -offset 0x80000000 -range 128M -target_address_space [get_bd_addr_spaces microblaze_0/Data] [get_bd_addr_segs mig_7series_0/memmap/memaddr]
assign_bd_address -offset 0x00000000 -range 64K -target_address_space [get_bd_addr_spaces microblaze_0/Instruction] [get_bd_addr_segs microblaze_0_local_memory/ilmb_bram_if_cntlr/SLMB/Mem]
assign_bd_address -offset 0x40010000 -range 64K -target_address_space [get_bd_addr_spaces microblaze_0/Instruction] [get_bd_addr_segs MB2_GPIO/S_AXI/Reg]
assign_bd_address -offset 0x40600000 -range 64K -target_address_space [get_bd_addr_spaces microblaze_0/Instruction] [get_bd_addr_segs axi_uartlite_0/S_AXI/Reg]
assign_bd_address -offset 0x41200000 -range 64K -target_address_space [get_bd_addr_spaces microblaze_0/Instruction] [get_bd_addr_segs microblaze_0_axi_intc/S_AXI/Reg]
assign_bd_address -offset 0x44A00000 -range 64K -target_address_space [get_bd_addr_spaces microblaze_0/Instruction] [get_bd_addr_segs PmodWIFI_0/AXI_LITE_SPI/Reg0]
assign_bd_address -offset 0x44A10000 -range 64K -target_address_space [get_bd_addr_spaces microblaze_0/Instruction] [get_bd_addr_segs PmodWIFI_0/S_AXI_TIMER/Reg0]
assign_bd_address -offset 0x44A20000 -range 64K -target_address_space [get_bd_addr_spaces microblaze_0/Instruction] [get_bd_addr_segs PmodWIFI_0/AXI_LITE_GPIO_WFCS/Reg0]
assign_bd_address -offset 0x44A30000 -range 64K -target_address_space [get_bd_addr_spaces microblaze_0/Instruction] [get_bd_addr_segs PmodWIFI_0/AXI_LITE_WFGPIO/Reg0]
assign_bd_address -offset 0x80000000 -range 128M -target_address_space [get_bd_addr_spaces microblaze_0/Instruction] [get_bd_addr_segs mig_7series_0/memmap/memaddr]
assign_bd_address -offset 0x00000000 -range 128K -target_address_space [get_bd_addr_spaces microblaze_1/Data] [get_bd_addr_segs microblaze_1_local_memory/dlmb_bram_if_cntlr/SLMB/Mem]
assign_bd_address -offset 0x00020000 -range 64K -target_address_space [get_bd_addr_spaces microblaze_1/Data] [get_bd_addr_segs microblaze_1_axi_intc/S_AXI/Reg]
assign_bd_address -offset 0x00030000 -range 64K -target_address_space [get_bd_addr_spaces microblaze_1/Data] [get_bd_addr_segs switch_led_out_0/S00_AXI/S00_AXI_reg]
assign_bd_address -offset 0x40000000 -range 64K -target_address_space [get_bd_addr_spaces microblaze_1/Data] [get_bd_addr_segs MB1_GPIO/S_AXI/Reg]
assign_bd_address -offset 0x40600000 -range 64K -target_address_space [get_bd_addr_spaces microblaze_1/Data] [get_bd_addr_segs axi_uartlite_0/S_AXI/Reg]
assign_bd_address -offset 0x80000000 -range 128M -target_address_space [get_bd_addr_spaces microblaze_1/Data] [get_bd_addr_segs mig_7series_0/memmap/memaddr]
assign_bd_address -offset 0xC0000000 -range 8K -target_address_space [get_bd_addr_spaces microblaze_1/Data] [get_bd_addr_segs axi_bram_ctrl_0/S_AXI/Mem0]
assign_bd_address -offset 0x00000000 -range 128K -target_address_space [get_bd_addr_spaces microblaze_1/Instruction] [get_bd_addr_segs microblaze_1_local_memory/ilmb_bram_if_cntlr/SLMB/Mem]

validate_bd_design
save_bd_design
